# EAGLE design LTC4060-3Cell (EAGLE 5.11)
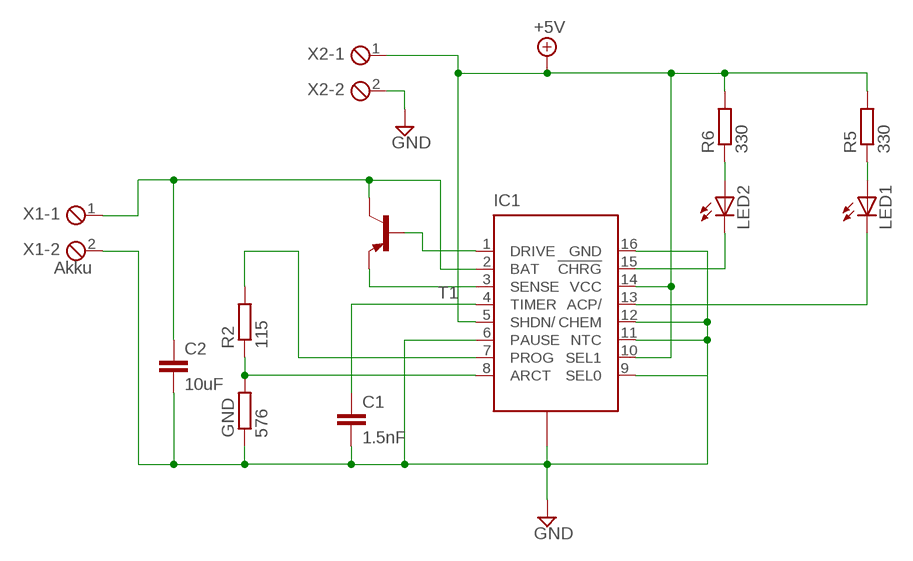
[diagram p0: schematic, sheet 1]

## Parts
C1  1.5nF  C-EU075-032X103  [C075-032X103]
C2  10uF  C-EUC1206  [C1206]
GND  576  R-EU_0207/12  [0207/12]
IC1  LTC4060FEFE  [TSSOP16-PAD]
LED1  LED3MM  [LED3MM]
LED2  LED3MM  [LED3MM]
R2  115  R-EU_0207/10  [0207/10]
R5  330  R-EU_0207/2V  [0207/2V]
R6  330  R-EU_0207/2V  [0207/2V]
T1  -PNP-TO220V  [TO220V]
X1  Akku  MPT2  [2POL254]
X2  MPT2  [2POL254]

## Nets
+5V: IC1.5(SHDN/) IC1.10(SEL1) IC1.14(VCC) R5.2 R6.2 X2.1
GND: C1.2 C2.2 GND.1 IC1.6(PAUSE) IC1.9(SEL0) IC1.11(NTC) IC1.12(CHEM) IC1.16(GND) IC1.17(PAD) X1.2 X2.2
N$1: GND.2 IC1.8(ARCT) R2.1
N$2: C1.1 IC1.4(TIMER)
N$3: IC1.7(PROG) R2.2
N$4: IC1.1(DRIVE) T1.1(B)
N$6: IC1.3(SENSE) T1.3(E)
N$7: C2.1 IC1.2(BAT) T1.2(C) X1.1
N$8: IC1.15(!CHRG) LED2.K(C)
N$9: LED1.A R5.1
N$10: IC1.13(ACP/) LED1.K(C)
N$11: LED2.A R6.1

## Library data of the parts
C1 C2 = resistor:C-EU: CAPACITOR, European symbol
GND R2 R5 R6 = resistor:R-EU_: RESISTOR, European symbol
IC1 = linear-technology-3:LTC4060FE
LED1 LED2 = led:LED: LED OSRAM: - CHIPLED LG R971, LG N971, LY N971, LG Q971, LY Q971, LO R971, LY R971 LH N974, LH R974 LS Q976, LO Q976, LY Q976 LO Q996 - Hyper CHIPLED LW Q18S LB Q993, LB Q99A, LB R99A - SideLED LS A670, LO A670, LY A670, LG A670, LP A670 LB A673, LV A673, LT A673, LW A673 LH A674 LY A675 LS A676, LA A676, LO A676, LY A676, LW A676 LS A679, LY A679, LG A679 - Hyper Micro SIDELED® LS Y876, LA Y876, LO Y876, LY Y876 LT Y87S - SmartLED LW L88C, LW L88S LB L89C, LB L89S, LG L890 LS L89K, LO L89K, LY L89K LS L896, LA L896, LO L896, LY L896 - TOPLED LS T670, LO T670, LY T670, LG T670, LP T670 LSG T670, LSP T670, LSY T670, LOP T670, LYG T670 LG T671, LOG T671, LSG T671 LB T673, LV T673, LT T673, LW T673 LH T674 LS T676, LA T676, LO T676, LY T676, LB T676, LH T676, LSB T676, LW T676 LB T67C, LV T67C, LT T67C, LS T67K, LO T67K, LY T67K, LW E67C LS E67B, LA E67B, LO E67B, LY E67B, LB E67C, LV E67C, LT E67C LW T67C LS T679, LY T679, LG T679 LS T770, LO T770, LY T770, LG T770, LP T770 LB T773, LV T773, LT T773, LW T773 LH T774 LS E675, LA E675, LY E675, LS T675 LS T776, LA T776, LO T776, LY T776, LB T776 LHGB T686 LT T68C, LB T68C - Hyper Mini TOPLED® LB M676 - Mini TOPLED Santana® LG M470 LS M47K, LO M47K, LY M47K Source: http://www.osram.convergy.de LUXEON: - LUMILED® LXK2-PW12-R00, LXK2-PW12-S00, LXK2-PW14-U00, LXK2-PW14-V00 LXK2-PM12-R00, LXK2-PM12-S00, LXK2-PM14-U00 LXK2-PE12-Q00, LXK2-PE12-R00, LXK2-PE12-S00, LXK2-PE14-T00, LXK2-PE14-U00 LXK2-PB12-K00, LXK2-PB12-L00, LXK2-PB12-M00, LXK2-PB14-N00, LXK2-PB14-P00, LXK2-PB14-Q00 LXK2-PR12-L00, LXK2-PR12-M00, LXK2-PR14-Q00, LXK2-PR14-R00 LXK2-PD12-Q00, LXK2-PD12-R00, LXK2-PD12-S00 LXK2-PH12-R00, LXK2-PH12-S00 LXK2-PL12-P00, LXK2-PL12-Q00, LXK2-PL12-R00 Source: www.luxeon.com KINGBRIGHT: KA-3528ASYC Source: www.kingbright.com
T1 = transistor:*-PNP-: PNP Transistror
X1 X2 = con-phoenix-254:MPT2: PHOENIX CONNECTOR; OC_FARNELL: unknown; OC_NEWARK: unknown

## Board
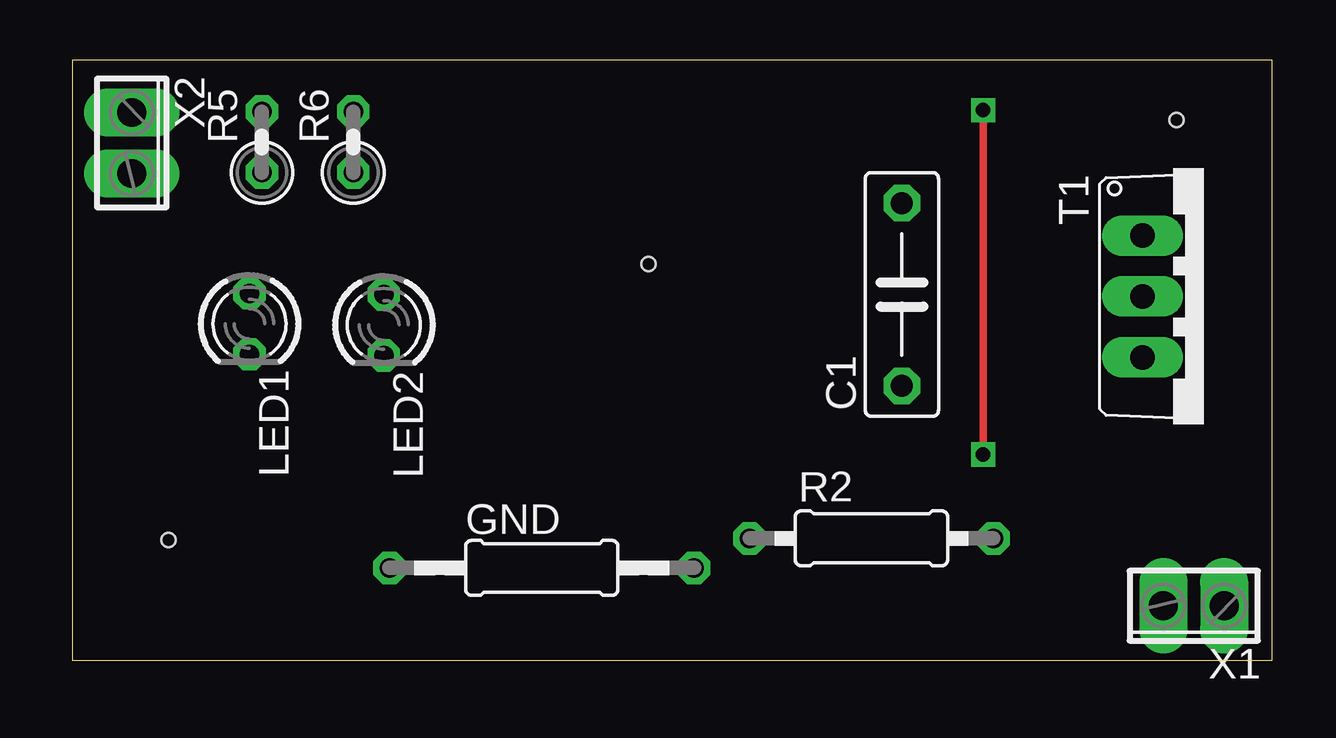
[diagram p1: board, top side]
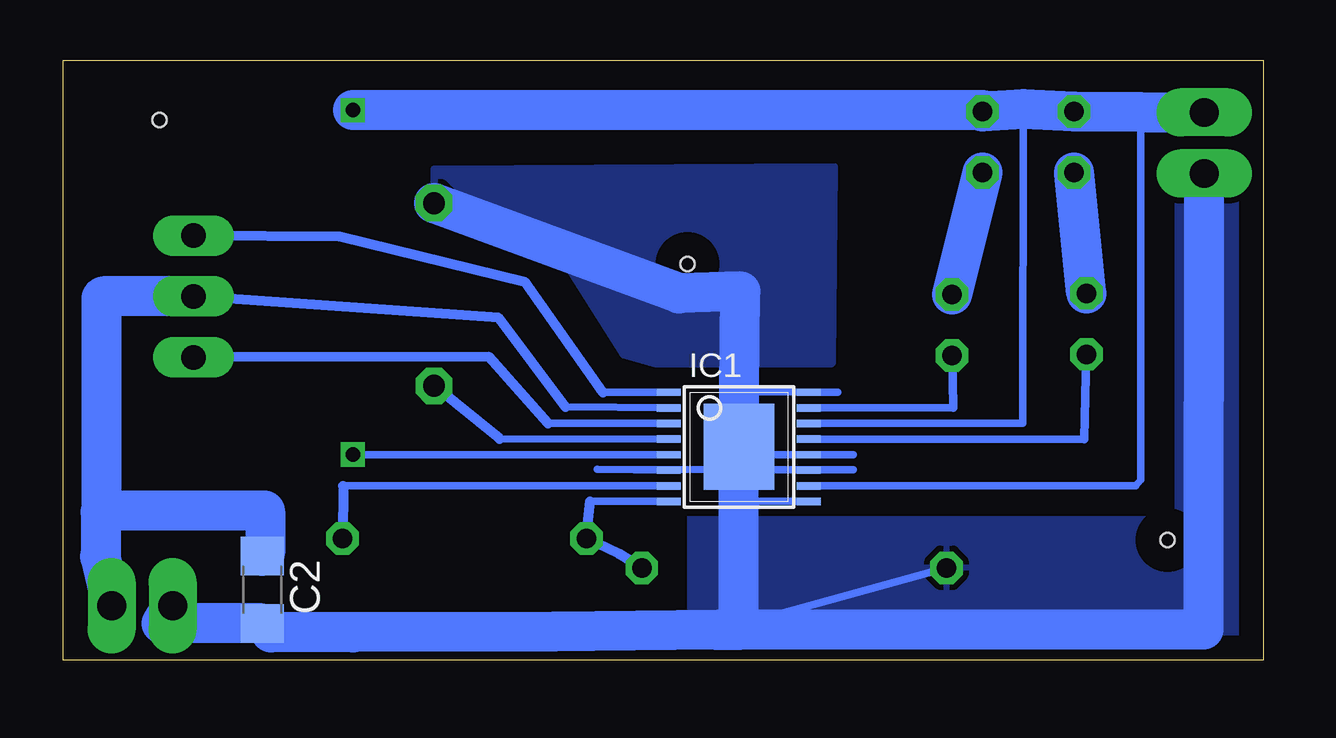
[diagram p2: board, bottom side, seen from below]

Size 50 x 25 mm. Coordinates in mm from the lower left corner, seen from the top.
Outline: 0,0 50,0 50,25 0,25 0,0
Copper layers (1*16): Top 0.035mm / dielectric 1.5mm / Bottom 0.035mm
Design rules "default *": minimum track width 10mil, minimum drill 24mil, track to track 8mil, track to pad 8mil, pad to pad 8mil, via to via 8mil, smd to smd 8mil, copper to edge 40mil, drill to drill 8mil, minimum pad ring 10mil, minimum via ring 8mil, stop-mask expansion 4mil, vias tented up to drill 0mil, thermal gap 10mil
Holes 0.6 mm at 24,16.5 4,5 46,22.5

### Footprints (pad centres in the part's own frame; a part is rotated, then mirrored left to right if it is on the bottom)
C075-032X103 = drill 0.914 octagon: 1 -3.81,0; 2 3.81,0
C1206 = smd 1.6 x 1.8: 1 -1.4,0; 2 1.4,0
0207/12 = drill 0.813 octagon: 1 -6.35,0; 2 6.35,0
TSSOP16-PAD = smd 0.305 x 0.991: 1 -2.275,-2.918; 2 -1.625,-2.918; 3 -0.975,-2.918; 4 -0.325,-2.918; 5 0.325,-2.918; 6 0.975,-2.918; 7 1.625,-2.918; 8 2.275,-2.918; 9 2.275,2.918; 10 1.625,2.918; 11 0.975,2.918; 12 0.325,2.918; 13 -0.325,2.918; 14 -0.975,2.918; 15 -1.625,2.918; 16 -2.275,2.918 | smd 3.58 x 2.94: 17 0,0
LED3MM = drill 0.813 octagon: A -1.27,0; K 1.27,0
0207/10 = drill 0.813 octagon: 1 -5.08,0; 2 5.08,0
0207/2V = drill 0.813 octagon: 1 -1.27,0; 2 1.27,0
TO220V = drill 1.016 long: 1 -2.54,-2.54; 2 0,-2.54; 3 2.54,-2.54
2POL254 = drill 1.2 long: 1 -1.27,0; 2 1.27,0

### Placement (x,y rotation side)
C1  34.56,15.23 90 top
C2  41.72,2.93 270 bottom
GND  19.55,3.84 0 top
IC1  21.86,8.88 270 bottom
LED1  7.37,14.01 270 top
LED2  12.97,13.96 270 top
R2  33.29,5.07 0 top
R5  7.89,21.58 90 top
R6  11.7,21.58 90 top
T1  47.13,15.15 270 top
X1  46.72,2.26 180 top
X2  2.47,21.54 270 top

### Tracks (layer width: path | path; a pad name or v marks a point on that pad's centre or on a via)
+5V  (via drill 0.6)
  Top 0.305: v37.94,22.91 v37.94,8.56
  Bottom 0.305: IC1.14 10.02,9.86 10,22.95 | IC1.10 5.32,7.26 5.11,7.5 5.11,22.36 5.14,22.83 | IC1.5 37.87,8.55 37.87,8.56 v37.94,8.56 | R6.2 11.7,22.91
  Bottom 1.676: R6.2 10,22.95 R5.2 5.14,22.83 X2.1 | 11.7,22.91 v37.94,22.91
GND
  Bottom 0.305: IC1.6 27.76,7.95 21.86,7.93 17.09,7.93 IC1.11 | IC1.16 17.73,11.17 21.84,11.17 | 17.08,8.56 IC1.12 21.4,8.55 IC1.17 | IC1.9 21.86,6.6 21.86,6.52 | 22.78,1.26 20.75,1.76 GND.1
  Bottom 1.676: 22.78,1.26 21.86,1.26 21.86,6.52 21.86,7.93 IC1.17 21.84,11.17 21.8,15.36 24.35,15.28 C1.2 | 22.78,1.26 29.55,1.18 37.94,1.15 41.34,1.15 C2.2 45.91,1.53 X1.2 | X2.2 2.5,1.27 22.78,1.26
  pour Bottom: 17.97,12.38 17.88,20.55 34.55,20.45 34.52,18.82 29.49,17.19 26.66,12.73 25.32,12.35 18,12.35
  pour Bottom: 0.85,20.97 3.69,20.99 3.69,5.99 24,6 24,1 0.85,0.97
N$1
  Bottom 0.305: 28.05,6.61 IC1.8
  Bottom 0.406: 28.05,6.61 R2.1 26.85,4.42 GND.2
N$2
  Bottom 0.305: IC1.4 31.83,9.21
  Bottom 0.406: 31.83,9.21 C1.1
N$3
  Bottom 0.305: IC1.7 38.35,7.26 38.35,7.25
  Bottom 0.406: 38.35,7.25 R2.2
N$4
  Bottom 0.305: IC1.1 27.53,11.15
  Bottom 0.406: 27.53,11.15 30.75,15.74 38.5,17.64 T1.1
N$5
  Bottom 0.406: 41.52,4.11 41.52,4.52
N$6
  Bottom 0.305: IC1.3 29.81,9.86
  Bottom 0.406: 29.81,9.86 32.27,12.63 T1.3
N$7
  Bottom 0.305: IC1.2 29.08,10.54
  Bottom 0.406: 29.08,10.54 31.87,14.26 T1.2
  Bottom 1.676: X1.1 48.47,4.31 48.45,4.32 48.45,6.17 48.38,6.24 | 48.38,6.24 41.63,6.24 41.59,6.2 41.59,4.45 C2.1 | T1.2 48.36,15.15 48.42,15.09 48.42,6.27 48.38,6.24
N$8
  Bottom 0.305: 12.92,10.51 IC1.15
  Bottom 0.357: 12.92,10.51 LED2.K
N$9
  Bottom 1.676: LED1.A R5.1
N$10
  Bottom 0.305: 7.47,9.2 IC1.13
  Bottom 0.357: 7.47,9.2 LED1.K
N$11
  Bottom 1.676: LED2.A R6.1